# EAGLE design TPS63001DRCR_Buck_Boost_Converter (EAGLE 9.6.2)
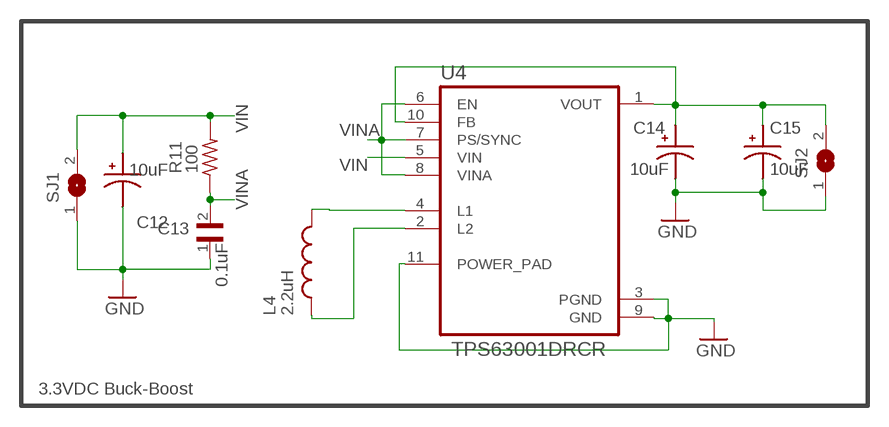
[diagram p0: schematic, sheet 1]

## Parts
C12  10uF  EEE-1CA100SR  [CAPAE430X550N]
C13  0.1uF  GRM188C81C106MA73J  [CAPC1608X100N]
C14  10uF  EEE-1CA100SR  [CAPAE430X550N]
C15  10uF  EEE-1CA100SR  [CAPAE430X550N]
L4  2.2uH  LQM18PN2R2MFHD  [INDC1608X95N]
R11  100  RP73PF2A10KBTDF  [RESC2012X65N]
SJ1  SJW  [SJW]
SJ2  SJW  [SJW]
U4  TPS63001DRCR  [VREG_V62/16624-01YE]

## Nets
3.3VDC: C14.1 C15.1 SJ2.2 U4.1(VOUT) U4.10(FB)
GND: C12.2 C13.1 C14.2 C15.2 SJ1.1 SJ2.1 U4.3(PGND) U4.9(GND) U4.11(POWER_PAD)
N$16: L4.2 U4.4(L1)
N$22: L4.1 U4.2(L2)
VIN: C12.1 R11.2 SJ1.2 U4.5(VIN)
VINA: C13.2 R11.1 U4.6(EN) U4.7(PS/SYNC) U4.8(VINA)

## Notes on the sheet
- 3.3VDC Buck-Boost

## Library data of the parts
C12 C14 C15 = EEE-1CA100SR_10uF_SMD:EEE-1CA100SR: Capacitor Alum Elec, 10uf, 16v, 20%, Scapacitor Alum Elec, 10uf, 16v, 20%, Smd, Full Reel Check prices <https://pricing.snapeda.com/search/part/EEE-1CA100SR/?ref=eda>; AVAILABILITY: Warning; DESCRIPTION: 10µF 16V Aluminum Electrolytic Capacitors Radial, Can - SMD 2000 Hrs @ 85°C; MF: Panasonic; MP: EEE-1CA100SR; PACKAGE: RADIAL Panasonic Electronic Components; PRICE: None; PURCHASE-URL: https://pricing.snapeda.com/search/part/EEE-1CA100SR/?ref=eda
C13 = Capacitor_10uF_smd_CAP-0135:GRM188C81C106MA73J: Cap Ceramic 10uF 16V X6S 20% Pad SMD 0603 105°C T/R Check prices <https://pricing.snapeda.com/search/part/GRM188C81C106MA73J/?ref=eda>; AVAILABILITY: Warning; DESCRIPTION: 10µF ±20% 16V Ceramic Capacitor X6S 0603 (1608 Metric); MF: Murata; MP: GRM188C81C106MA73J; PACKAGE: 1608 Murata; PRICE: None; PURCHASE-URL: https://pricing.snapeda.com/search/part/GRM188C81C106MA73J/?ref=eda
L4 = SMD_inductor_2.2uH:LQM18PN2R2MFHD: Inductor Power Chip Shielded Multi-Layer 2.2uH 20% 1MHz Ferrite 700mA 375mOhm DCR 0603 T/R Check prices <https://pricing.snapeda.com/search/part/LQM18PN2R2MFHD/?ref=eda>; AVAILABILITY: Warning; DESCRIPTION: Inductor with Inductance: 2.2uH Tol. +/-20%, Package: 0603 (1608); MF: Murata; MP: LQM18PN2R2MFHD; PACKAGE: 1608 Murata; PRICE: None; PURCHASE-URL: https://pricing.snapeda.com/search/part/LQM18PN2R2MFHD/?ref=eda
R11 = SMD_Res_10k:RP73PF2A10KBTDF: RES, THIN FILM, 10K, 0.1%, 0.25W, 0805 Check prices <https://pricing.snapeda.com/search/part/RP73PF2A10KBTDF/?ref=eda>; AVAILABILITY: Warning; DESCRIPTION: 10 kOhms ±0.1% 0.25W, 1/4W Chip Resistor 0805 (2012 Metric) Thin Film; MF: TE Connectivity; MP: RP73PF2A10KBTDF; PACKAGE: 0805 TE Connectivity; PRICE: None; PURCHASE-URL: https://pricing.snapeda.com/search/part/RP73PF2A10KBTDF/?ref=eda
SJ1 SJ2 = jumper:SJ: SMD solder JUMPER
U4 = ASP_TPS63001DRCR:TPS63001DRCR: Check prices <https://pricing.snapeda.com/search/part/TPS63001DRCR/?ref=eda>; AVAILABILITY: Warning; DESCRIPTION: 96% Buck-Boost Converter with 1.7A Current Switches, 3.3V fixed Output voltage in 3x3 QFN 10-VSON -40 to 85; MF: Texas Instruments; MP: TPS63001DRCR; PACKAGE: VSON-10 Texas Instruments; PRICE: None; PURCHASE-URL: https://pricing.snapeda.com/search/part/TPS63001DRCR/?ref=eda

## Board
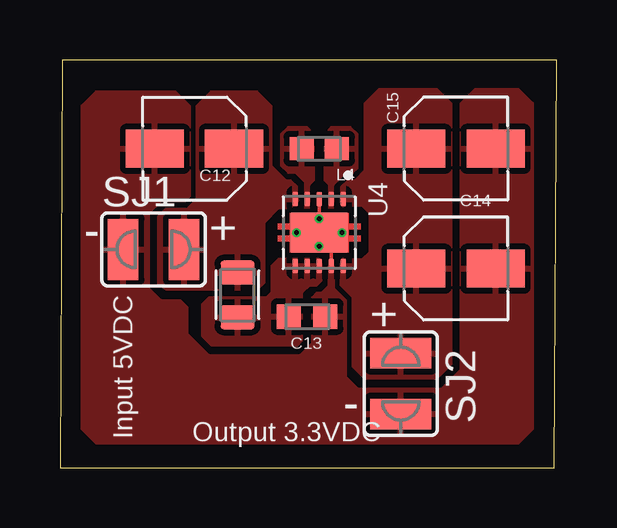
[diagram p1: board, top side]

Size 20.7 x 17 mm. Coordinates in mm from the lower left corner, seen from the top.
Outline: 0,0 20.6,0 20.7,17 0.1,17 0,0
Copper layers (1*16): Top 0.035mm / dielectric 1.5mm / Bottom 0.035mm
Design rules "default *": minimum track width 6mil, minimum drill 0.35mm, track to track 6mil, track to pad 6mil, pad to pad 6mil, via to via 6mil, smd to smd 6mil, copper to edge 10mil, drill to drill 0.2mm, minimum pad ring 3mil, minimum via ring 8mil, stop-mask expansion 4mil, vias tented up to drill 0mil, thermal gap 10mil

### Footprints (pad centres in the part's own frame; a part is rotated, then mirrored left to right if it is on the bottom)
CAPAE430X550N = smd 2.42 x 1.58: 1 -1.65,0; 2 1.65,0
CAPC1608X100N = smd 1 x 1.02: 1 -0.759,0; 2 0.759,0
INDC1608X95N = smd 1 x 0.97: 1 -0.735,0; 2 0.735,0
RESC2012X65N = smd 1 x 1.42: 1 -0.935,0; 2 0.935,0
SJW = smd 1.27 x 2.54: 1 -1.27,0; 2 1.27,0
VREG_V62/16624-01YE = smd 0.6 x 0.24: 1 -1.4,1; 2 -1.4,0.5; 3 -1.4,0; 4 -1.4,-0.5; 5 -1.4,-1; 6 1.4,-1; 7 1.4,-0.5; 8 1.4,0; 9 1.4,0.5; 10 1.4,1 | smd 1.65 x 2.4: 11 0,0 | drill 0.2 pad 0.3: 12 0,-0.95; 13 -0.575,0; 14 0.575,0; 15 0,0.95

### Placement (x,y rotation side)
C12  5.6,13.3 180 top
C13  10.3,6.3 180 top
C14  16.5,8.3 0 top
C15  16.5,13.3 0 top
L4  10.8,13.3 180 top
R11  7.4,7.2 90 top
SJ1  3.9,9.1 0 top
SJ2  14.2,3.5 90 top
U4  10.8,9.8 270 top

### Tracks (layer width: path | path; a pad name or v marks a point on that pad's centre or on a via)
3.3VDC
  pour Top: 11.7,11 11.7,11.7 12,12 12.3,12 12.7,12.4 12.7,15.2 13.3,15.8 15.7,15.8 16.3,15.2 16.3,4.3 15.7,3.7 12.7,3.7 12.2,4.2 12.2,7.1 11.7,7.6 11.7,8.6 11.8,8.7 12.6,8.7 12.9,9 12.9,10.6 12.6,10.9 11.8,10.9
GND
  Top 0.152: U4.3 U4.11 11.3,9.3 U4.9
  pour Top: 5.4,15.1 5.4,11.3 5.2,11.1 4.2,11.1 3.7,10.6 3.7,7.5 4.2,7 5,7 5.3,6.7 5.3,5.6 6.2,4.7 10,4.7 10.5,5.2 10.5,7.1 10.7,7.3 10.9,7.3 11.2,7.6 11.2,8.4 11.4,8.4 11.4,7.5 11.9,7 11.9,3.8 12.4,3.3 15.9,3.3 16.7,4.1 16.7,15.2 17.3,15.8 19.1,15.8 19.7,15.2 19.7,1.6 19.1,1 1.5,1 0.9,1.6 0.9,15.1 1.5,15.7 4.8,15.7
N$16
  pour Top: 9.2,13.9 9.2,12.6 9.5,12.3 9.8,12.3 10.2,11.9 10.2,10.8 10.4,10.8 10.4,11.8 10.6,12 10.6,13.9 10.3,14.2 9.5,14.2
N$22
  pour Top: 11,13.9 11,12 11.2,11.8 11.2,10.8 11.4,10.8 11.4,11.8 11.9,12.3 12.2,12.3 12.4,12.5 12.4,13.9 12.1,14.2 11.3,14.2
VIN
  pour Top: 4.1,7.65 4.1,10.5 4.4,10.8 5.3,10.8 5.7,11.2 5.7,15.1 6.3,15.7 8.2,15.7 8.8,15.1 8.8,12.6 9.4,12 9.6,12 9.9,11.7 9.9,11.1 9.6,10.8 9.1,10.8 8.5,10.2 8.5,7.7 8.2,7.4 4.43,7.4
VINA
  pour Top: 6.2,7.1 5.9,6.8 5.9,5.5 6.3,5.1 9.9,5.1 10.1,5.3 10.1,7.3 10.4,7.6 10.7,7.6 10.9,7.8 10.9,8.6 10.8,8.7 9.1,8.7 8.8,8.4 8.8,7.3 8.6,7.1

### Text on the board
tNames: - | + | Input 5VDC | + | - | Output 3.3VDC